# Altium project PCB_Project1.PrjPCB
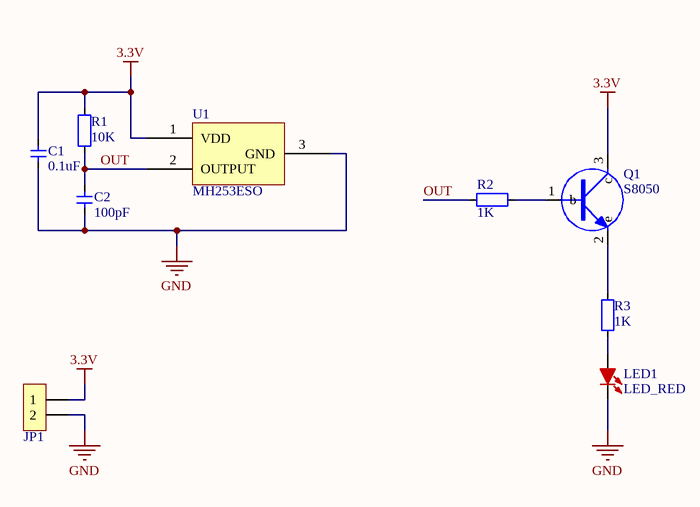
[diagram p0: Sheet1.SchDoc]
1 sheet, 9 parts. Net scope: global (net labels, ports and power ports of the same name join across sheets).
Board files: PCB1.PcbDoc, DBS3100霍尔_V0.4.PCBDOC, DBS3100霍尔_V0.5.PCBDOC

## Sheet Sheet1.SchDoc
size A4

### Parts
C1  0.1uF  [C 0603]
C2  100pF  [C 0603]
JP1  HDR-1X2  [HDR-1X2]  (value not drawn)
LED1  LED_RED  [LED 0603B]
Q1  S8050  [SOT23-3L]
R1  10K  [R 0603]
R2  1K  [R 0603]
R3  1K  [R 0603]
U1  MH253ESO  [MH253ESO]

### Nets
3.3V: C1.2 JP1.1 Q1.3(c) R1.2 U1.1(VDD)
GND: C1.1 C2.1 JP1.2 LED1.2(K) U1.3(GND)
OUT: C2.2 R1.1 R2.1 U1.2(OUTPUT)
NetLED1_1: LED1.1(A) R3.1
NetQ1_1: Q1.1(b) R2.2
NetQ1_2: Q1.2(e) R3.2

### Library data of the parts
C1 C2 = C: 无极性贴片电容; 版权归属: 源创客; BOM名称: 无极性贴片电容; 学习资源: www.ooocke.com
JP1 = Header 2: 2P接插件; 版权归属: 源创客; BOM名称: 2P接插件; 学习资源: www.ooocke.com
Q1 = NPN
R1-R3 = R: 贴片电阻; 版权归属: 源创客; BOM名称: 贴片电阻; 学习资源: www.ooocke.com
U1 = MH253ESO: 全极霍尔效应开关